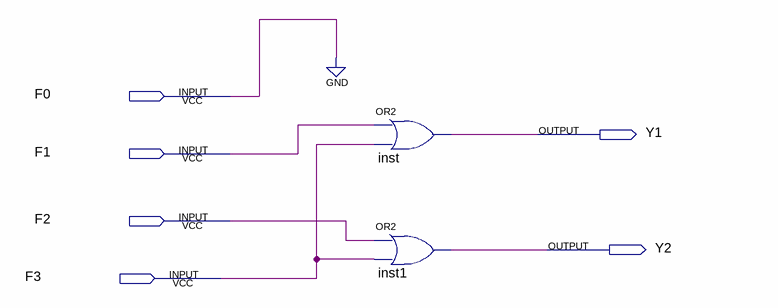
[diagram p0: schematic sheet]
// Quartus schematic Nuevo_4a2.bdf as structural Verilog: 2 symbols, 6 pins
module Nuevo_4a2 (
  input  F0,
  input  F1,
  input  F2,
  input  F3,
  output Y1,
  output Y2
);

  or inst (Y1, F1, F3);
  or inst1 (Y2, F2, F3);
  // also tied to GND on the sheet: F0
endmodule
